# Altium schematic sheet SWITCHES.SchDoc
size B; SheetNumber: 6; SheetTotal: 6
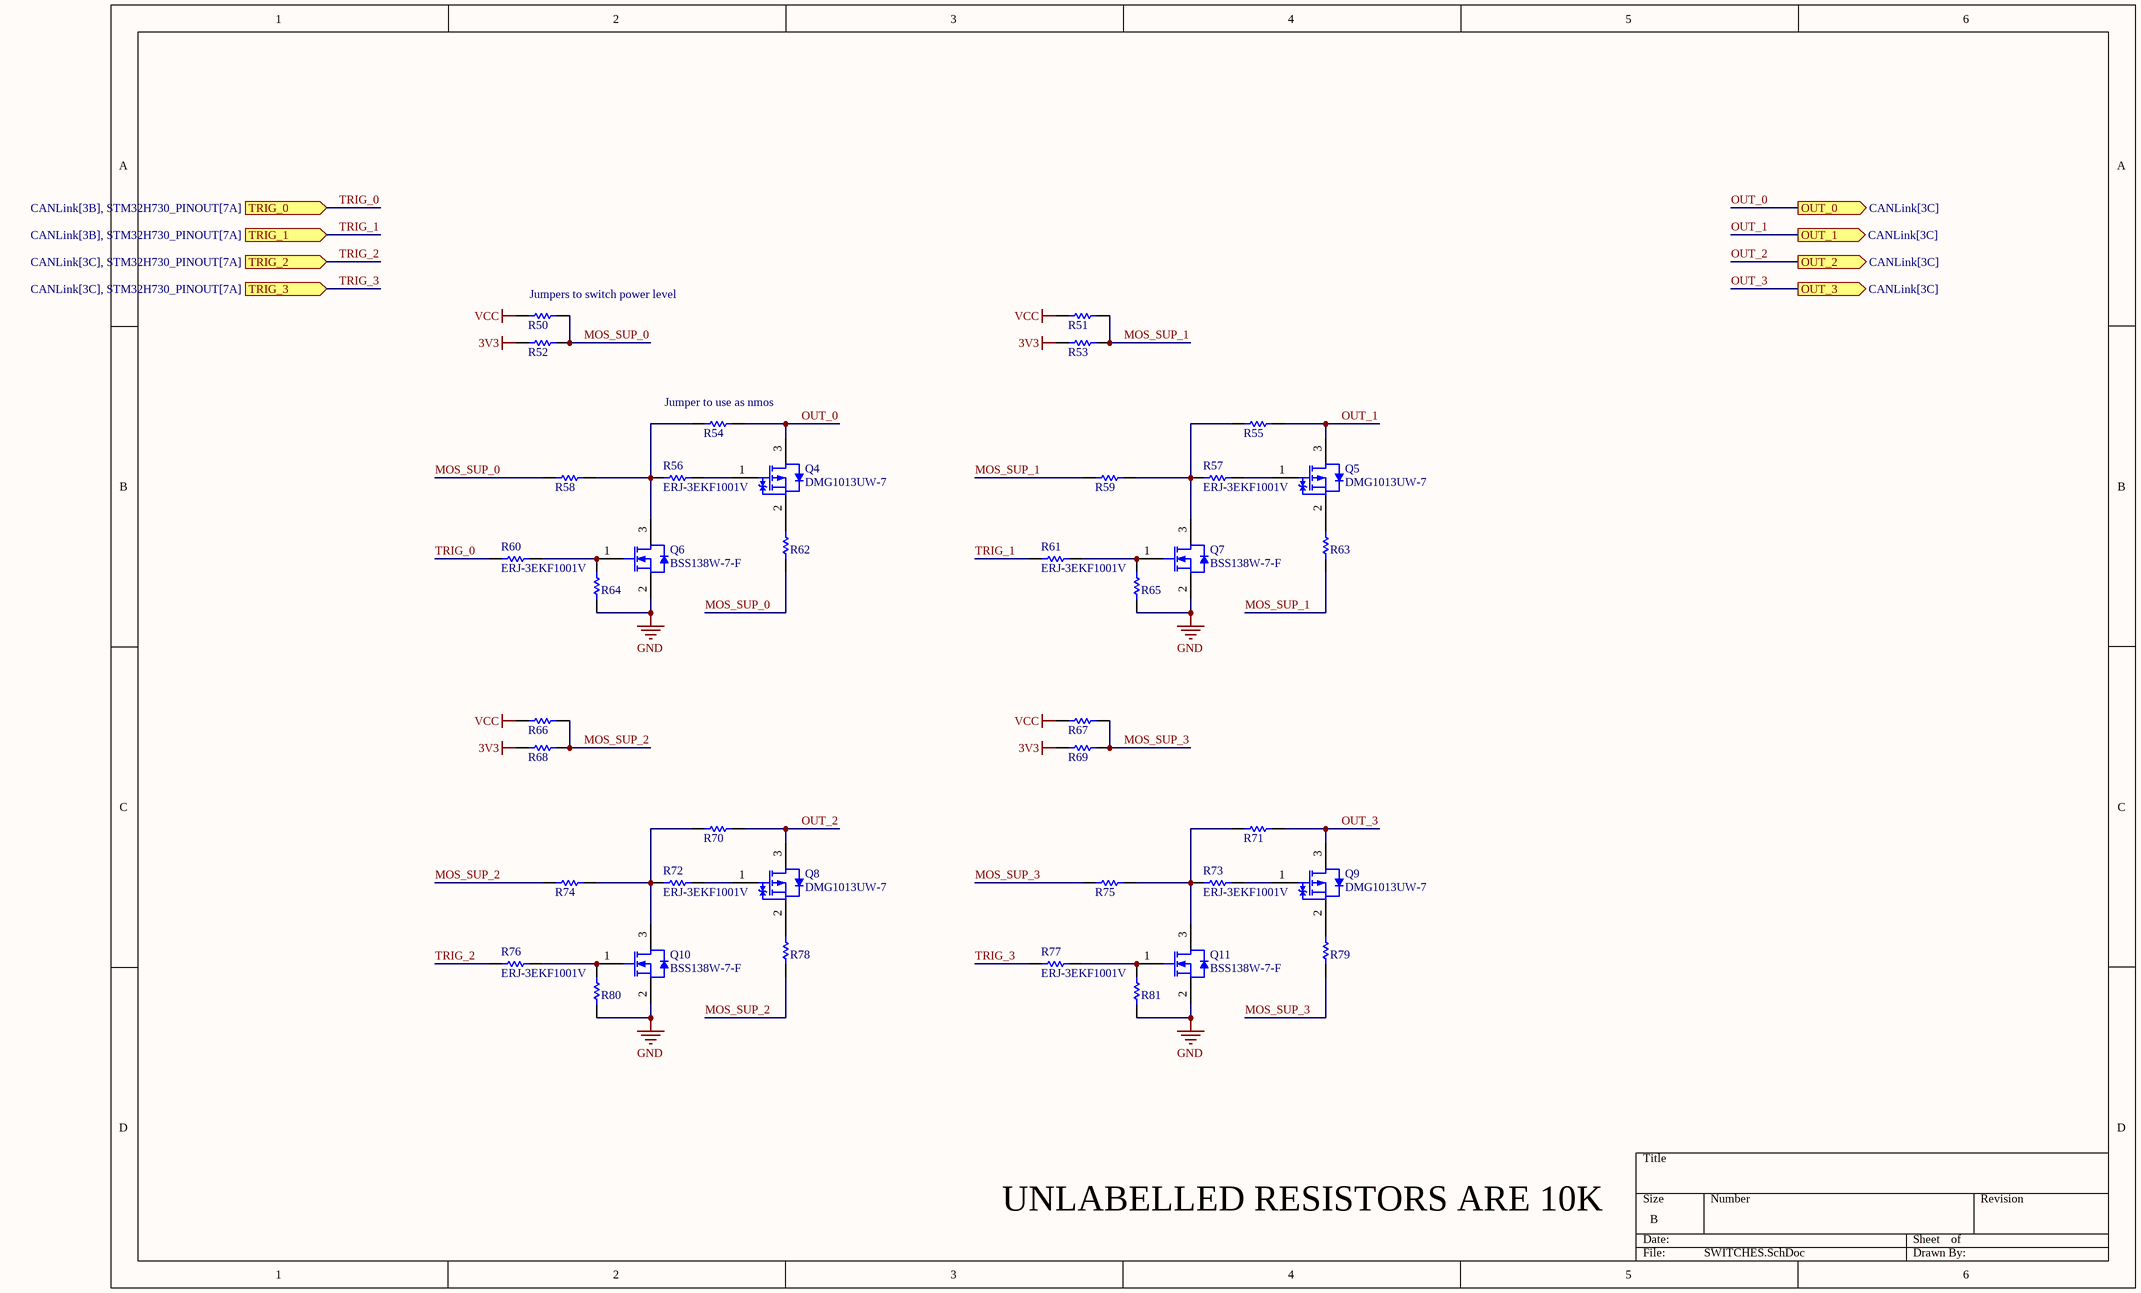
[diagram p0: SWITCHES.SchDoc]

## Parts
Q4  DMG1013UW-7  [DIOD-SOT323-3_V]
Q5  DMG1013UW-7  [DIOD-SOT323-3_V]
Q6  BSS138W-7-F  [DIOD-SOT323-3_V]
Q7  BSS138W-7-F  [DIOD-SOT323-3_V]
Q8  DMG1013UW-7  [DIOD-SOT323-3_V]
Q9  DMG1013UW-7  [DIOD-SOT323-3_V]
Q10  BSS138W-7-F  [DIOD-SOT323-3_V]
Q11  BSS138W-7-F  [DIOD-SOT323-3_V]
R50  0402 JUMPER 0 OHM  [RESC1005X40X25NL05T05]  (value not drawn)
R51  0402 JUMPER 0 OHM  [RESC1005X40X25NL05T05]  (value not drawn)
R52  0402 JUMPER 0 OHM  [RESC1005X40X25NL05T05]  (value not drawn)
R53  0402 JUMPER 0 OHM  [RESC1005X40X25NL05T05]  (value not drawn)
R54  0402 JUMPER 0 OHM  [RESC1005X40X25NL05T05]  (value not drawn)
R55  0402 JUMPER 0 OHM  [RESC1005X40X25NL05T05]  (value not drawn)
R56  ERJ-3EKF1001V  [RESC1608X55X30LL15T15]
R57  ERJ-3EKF1001V  [RESC1608X55X30LL15T15]
R58  ERJ3EKF1002V  [RESC1609X55X30LL15T15]  (value not drawn)
R59  ERJ3EKF1002V  [RESC1609X55X30LL15T15]  (value not drawn)
R60  ERJ-3EKF1001V  [RESC1608X55X30LL15T15]
R61  ERJ-3EKF1001V  [RESC1608X55X30LL15T15]
R62  ERJ3EKF1002V  [RESC1609X55X30LL15T15]  (value not drawn)
R63  ERJ3EKF1002V  [RESC1609X55X30LL15T15]  (value not drawn)
R64  ERJ3EKF1002V  [RESC1609X55X30LL15T15]  (value not drawn)
R65  ERJ3EKF1002V  [RESC1609X55X30LL15T15]  (value not drawn)
R66  0402 JUMPER 0 OHM  [RESC1005X40X25NL05T05]  (value not drawn)
R67  0402 JUMPER 0 OHM  [RESC1005X40X25NL05T05]  (value not drawn)
R68  0402 JUMPER 0 OHM  [RESC1005X40X25NL05T05]  (value not drawn)
R69  0402 JUMPER 0 OHM  [RESC1005X40X25NL05T05]  (value not drawn)
R70  0402 JUMPER 0 OHM  [RESC1005X40X25NL05T05]  (value not drawn)
R71  0402 JUMPER 0 OHM  [RESC1005X40X25NL05T05]  (value not drawn)
R72  ERJ-3EKF1001V  [RESC1608X55X30LL15T15]
R73  ERJ-3EKF1001V  [RESC1608X55X30LL15T15]
R74  ERJ3EKF1002V  [RESC1609X55X30LL15T15]  (value not drawn)
R75  ERJ3EKF1002V  [RESC1609X55X30LL15T15]  (value not drawn)
R76  ERJ-3EKF1001V  [RESC1608X55X30LL15T15]
R77  ERJ-3EKF1001V  [RESC1608X55X30LL15T15]
R78  ERJ3EKF1002V  [RESC1609X55X30LL15T15]  (value not drawn)
R79  ERJ3EKF1002V  [RESC1609X55X30LL15T15]  (value not drawn)
R80  ERJ3EKF1002V  [RESC1609X55X30LL15T15]  (value not drawn)
R81  ERJ3EKF1002V  [RESC1609X55X30LL15T15]  (value not drawn)

## Ports
OUT_0 (out, see CANLink[3C]), OUT_1 (out, see CANLink[3C]), OUT_2 (out, see CANLink[3C]), OUT_3 (out, see CANLink[3C]), TRIG_0 (in, see CANLink[3B], STM32H730_PINOUT[7A]), TRIG_1 (in, see CANLink[3B], STM32H730_PINOUT[7A]), TRIG_2 (in, see CANLink[3C], STM32H730_PINOUT[7A]), TRIG_3 (in, see CANLink[3C], STM32H730_PINOUT[7A])

## Nets
3V3: R52.1 R53.1 R68.1 R69.1
GND: Q6.2(S) Q7.2(S) Q10.2(S) Q11.2(S) R64.1 R65.1 R80.1 R81.1
VCC: R50.1 R51.1 R66.1 R67.1
MOS_SUP_0: R50.2 R52.2 R58.2 R62.1
MOS_SUP_1: R51.2 R53.2 R59.2 R63.1
MOS_SUP_2: R66.2 R68.2 R74.2 R78.1
MOS_SUP_3: R67.2 R69.2 R75.2 R79.1
OUT_0: Q4.3(D) R54.2 ; port OUT_0
OUT_1: Q5.3(D) R55.2 ; port OUT_1
OUT_2: Q8.3(D) R70.2 ; port OUT_2
OUT_3: Q9.3(D) R71.2 ; port OUT_3
TRIG_0: R60.1 ; port TRIG_0
TRIG_1: R61.1 ; port TRIG_1
TRIG_2: R76.1 ; port TRIG_2
TRIG_3: R77.1 ; port TRIG_3
NetQ4_1: Q4.1(G) R56.2
NetQ4_2: Q4.2(S) R62.2
NetQ5_1: Q5.1(G) R57.2
NetQ5_2: Q5.2(S) R63.2
NetQ6_1: Q6.1(G) R60.2 R64.2
NetQ6_3: Q6.3(D) R54.1 R56.1 R58.1
NetQ7_1: Q7.1(G) R61.2 R65.2
NetQ7_3: Q7.3(D) R55.1 R57.1 R59.1
NetQ8_1: Q8.1(G) R72.2
NetQ8_2: Q8.2(S) R78.2
NetQ9_1: Q9.1(G) R73.2
NetQ9_2: Q9.2(S) R79.2
NetQ10_1: Q10.1(G) R76.2 R80.2
NetQ10_3: Q10.3(D) R70.1 R72.1 R74.1
NetQ11_1: Q11.1(G) R77.2 R81.2
NetQ11_3: Q11.3(D) R71.1 R73.1 R75.1

## Notes on the sheet
- (near R50) Jumpers to switch power level
- (near R54) Jumper to use as nmos
- UNLABELLED RESISTORS ARE 10K

## Library data of the parts
Q4 Q5 Q8 Q9 = CMP-2000-06170-1: P-Channel Enhancement Mode MOSFET, 310 mW, 20 V, -55 to 150 degC, 3-Pin SOT-323, RoHS, Tape and Reel; Manufacturer: Diodes Inc; Qg Gate Charge: 0.622nC; Drain-Source On Resistance-Max: 750mO; Rated Power Dissipation: 310mW; Drain-to-Source Voltage [Vdss]: 20V; Package Reference: SOT323; Datasheet Version: Rev. 3-2, 09/2013; Package Description: 3-Pin Small Outline Transistor, Body 2 x 1.25 mm, Pitch 0.65 mm; Mounting Technology: SurfaceMount; Manufacturer URL: http://www.diodes.com/; Datasheet URL: http://www.diodes.com/_files/datasheets/ds31861.pdf; Channel Type: P-Channel
Q6 Q7 Q10 Q11 = CMP-2000-05968-1: N-Channel Enhancement Mode Mosfet, 50 V, 200 mA, -55 to 150 degC, 6-Pin SOT-323, RoHS, Tape and Reel; Typical Turn-Off Delay Time: 20ns; Number of Channels: 1Channel; Type: EnhancementModeFieldEffectTransistor; Brand: DiodesIncorporated; Vds - Drain-Source Breakdown Voltage: 75V; Vgs - Gate-Source Voltage: 20V; Rds On - Drain-Source Resistance: 1.4Ohms; Transistor Type: 1N-Channel; Configuration: Single; Unit Weight: 0.000212oz; Pd - Power Dissipation: 200mW; Id - Continuous Drain Current: 200mA; Forward Transconductance - Min: 0.1S; Manufacturer URL: http://www.diodes.com/; Series: BSS138; Package Description: 3-Pin Small Outline Transistor, Body 2 x 1.25 mm, Pitch 0.65 mm; Mounting Technology: SurfaceMount; Product Category: MOSFET; RoHS: True; Maximum Operating Temperature: +150C; Height: 1mm; Length: 2.2mm; Technology: Si; Width: 1.35mm; Datasheet URL: http://www.diodes.com/_files/datasheets/ds30206.pdf; Manufacturer: DiodesIncorporated; Package / Case: SOT-323-3; Typical Turn-On Delay Time: 20ns; Transistor Polarity: N-Channel; Factory Pack Quantity: 3000; Packaging: Reel; Product: MOSFETSmallSignal; Datasheet Version: Rev. 11-2, 09/2013; Package Reference: SOT323; Minimum Operating Temperature: -55C; Mounting Style: SMD/SMT; Channel Mode: Enhancement
R50-R55 R66-R71 = CMP-009-00206-2: READ THE NAME
R56 R57 R60 R61 R72 R73 R76 R77 = CMP-2000-00180-1: Manufacturer: Panasonic; Part Number: ERJ-3EKF1001V
R58 R59 R62-R65 R74 R75 R78-R81 = CMP-1012-00623-3: Chip Resistor, 10 KOhm, +/- 1%, 0.1 W, -55 to 155 degC, 0603 (1608 Metric), RoHS, Tape and Reel; Manufacturer: Panasonic; Voltage Rating: 75V; Case\/Package: 0603; Power Rating: 100mW; Resistance: 10KOhm; Temperature Coefficient: 100ppm\/degreesC; Number of Pins: 2; Package Reference: 603; Depth: 0.8mm; Mount: SurfaceMount; Package Description: 2-Pin Surface Mount Device, Body 1.6 x 0.85 mm; Datasheet Version: 02/2017; Length: 1.6mm; Lead Free: LeadFree; Height: 0.45mm; Number of Terminations: 2; Max Power Dissipation: 100mW; Min Operating Temperature: -55degC; Datasheet URL: https://industrial.panasonic.com/cdbs/www-data/pdf/RDA0000/AOA0000C304.pdf; Termination: SMD/SMT; Case Code (Metric): 1608; Case Code (Imperial): 0603; Tolerance: 1%; Max Operating Temperature: 155degC; RoHSCompliant: true; Voltage Rating (DC): 75V; Radiation Hardening: No; Packaging: TapeandReel; Composition: ThickFilm; Mounting Technology: SurfaceMount; Manufacturer URL: http://www.panasonic.com/; Width: 0.031inch; REACH SVHC: NoSVHC; Contact Plating: Tin; Military Standard: Not; Package Quantity: 1